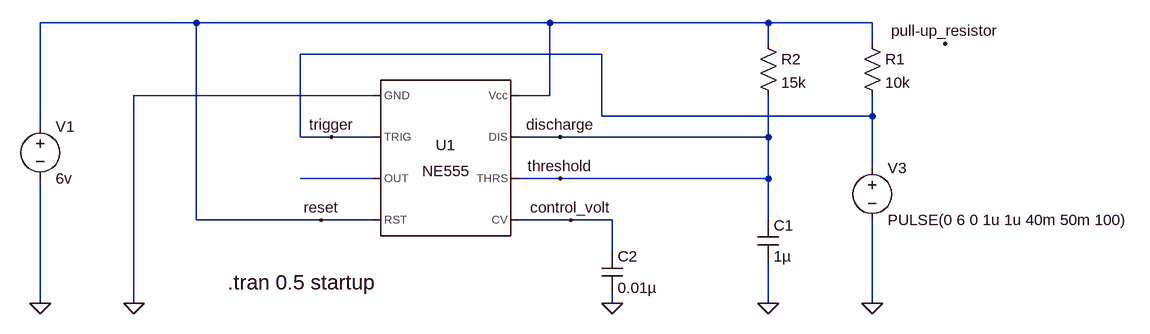
[diagram p0: schematic timer555_monostable_.asc]
timer555_monostable_.asc, the LTspice schematic file:
Version 4
SHEET 1 1228 680
WIRE -240 -48 -480 -48
WIRE 304 -48 -240 -48
WIRE 640 -48 304 -48
WIRE 800 -48 640 -48
WIRE 640 -16 640 -48
WIRE 800 -16 800 -48
WIRE 384 0 -80 0
WIRE 32 64 -336 64
WIRE 304 64 304 -48
WIRE 304 64 256 64
WIRE 384 96 384 0
WIRE 800 96 800 64
WIRE 800 96 384 96
WIRE -480 112 -480 -48
WIRE -80 128 -80 0
WIRE -32 128 -80 128
WIRE 32 128 -32 128
WIRE 320 128 256 128
WIRE 640 128 640 64
WIRE 640 128 320 128
WIRE 800 176 800 96
WIRE 32 192 -80 192
WIRE 320 192 256 192
WIRE 640 192 640 128
WIRE 640 192 320 192
WIRE -240 256 -240 -48
WIRE -48 256 -240 256
WIRE 32 256 -48 256
WIRE 336 256 256 256
WIRE 400 256 336 256
WIRE 640 256 640 192
WIRE 400 304 400 256
WIRE -480 384 -480 192
WIRE -336 384 -336 64
WIRE 400 384 400 368
WIRE 640 384 640 320
WIRE 800 384 800 256
FLAG -336 384 0
FLAG -480 384 0
FLAG -32 128 trigger
FLAG -48 256 reset
FLAG 640 384 0
FLAG 400 384 0
FLAG 320 128 discharge
FLAG 320 192 threshold
FLAG 336 256 control_volt
FLAG 800 384 0
FLAG 912 -16 pull-up_resistor
SYMBOL Misc\\NE555 144 160 R0
SYMATTR InstName U1
SYMBOL voltage -480 96 R0
WINDOW 123 0 0 Left 0
WINDOW 39 0 0 Left 0
SYMATTR InstName V1
SYMATTR Value 6v
SYMBOL res 784 -32 R0
SYMATTR InstName R1
SYMATTR Value 10k
SYMBOL res 624 -32 R0
SYMATTR InstName R2
SYMATTR Value 15k
SYMBOL cap 624 256 R0
SYMATTR InstName C1
SYMATTR Value 1µ
SYMBOL cap 384 304 R0
SYMATTR InstName C2
SYMATTR Value 0.01µ
SYMBOL voltage 800 160 R0
WINDOW 123 0 0 Left 0
WINDOW 39 0 0 Left 0
SYMATTR InstName V3
SYMATTR Value PULSE(0 6 0 1u 1u 40m 50m 100)
TEXT -192 352 Left 3 !.tran 0.5 startup

The netlist it stands for:
* timer555_monostable_.asc
XU1 0 trigger N001 reset control_volt threshold threshold reset NE555  ; pins GND TRIG OUT RST CV THRS DIS Vcc
V1 reset 0 6v
R1 reset trigger 10k
R2 reset threshold 15k
C1 threshold 0 1µ
C2 control_volt 0 0.01µ
V3 trigger 0 PULSE(0 6 0 1u 1u 40m 50m 100)
.tran 0.5 startup
.lib NE555.sub
.backanno
.end